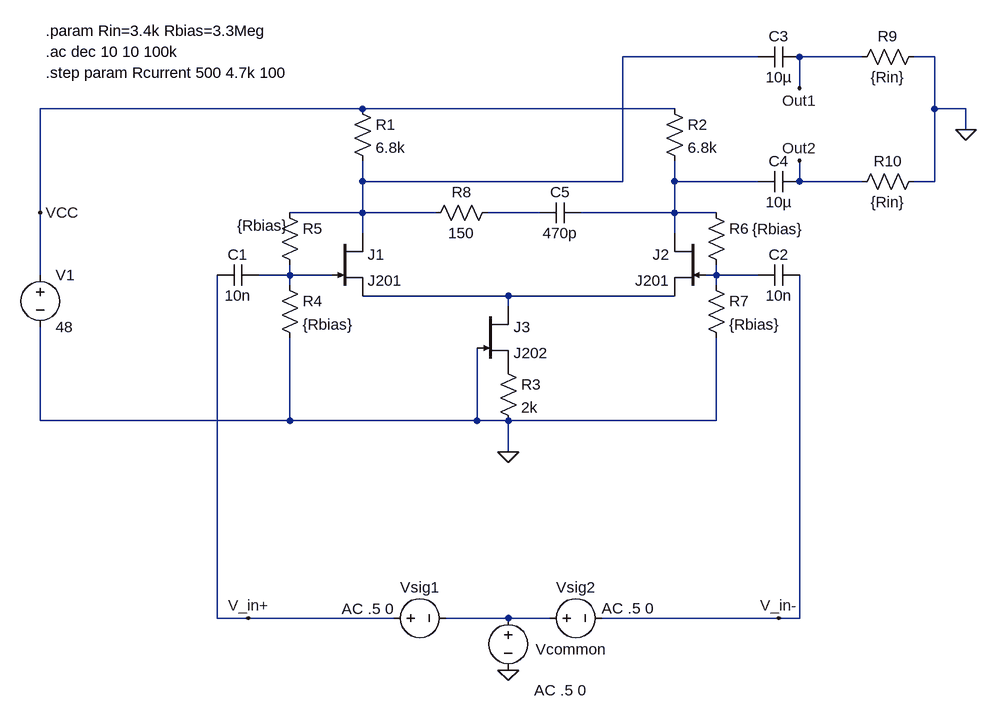
[diagram p0: schematic Preamp_LoGain.asc]
Preamp_LoGain.asc, the LTspice schematic file:
Version 4
SHEET 1 1804 1088
WIRE 928 96 720 96
WIRE 1088 96 992 96
WIRE 1200 96 1168 96
WIRE 992 144 992 96
WIRE 320 176 -176 176
WIRE 800 176 320 176
WIRE 1200 176 1200 96
WIRE 1248 176 1200 176
WIRE 1248 208 1248 176
WIRE 320 288 320 256
WIRE 720 288 720 96
WIRE 720 288 320 288
WIRE 800 288 800 256
WIRE 928 288 800 288
WIRE 992 288 992 256
WIRE 1088 288 992 288
WIRE 1200 288 1200 176
WIRE 1200 288 1168 288
WIRE -176 336 -176 176
WIRE 320 336 320 288
WIRE 320 336 208 336
WIRE 432 336 320 336
WIRE 592 336 512 336
WIRE 800 336 800 288
WIRE 800 336 656 336
WIRE 864 336 800 336
WIRE 320 368 320 336
WIRE 800 368 800 336
WIRE -176 432 -176 336
WIRE 208 432 208 416
WIRE 208 432 160 432
WIRE 272 432 208 432
WIRE 864 432 864 416
WIRE 864 432 848 432
WIRE 928 432 864 432
WIRE 208 448 208 432
WIRE 864 448 864 432
WIRE 544 464 320 464
WIRE 800 464 544 464
WIRE 544 480 544 464
WIRE -176 656 -176 512
WIRE 208 656 208 528
WIRE 208 656 -176 656
WIRE 496 656 496 544
WIRE 496 656 208 656
WIRE 544 656 496 656
WIRE 864 656 864 528
WIRE 864 656 544 656
WIRE 544 704 544 656
WIRE 96 960 96 432
WIRE 144 960 96 960
WIRE 368 960 144 960
WIRE 544 960 448 960
WIRE 608 960 544 960
WIRE 960 960 688 960
WIRE 992 960 992 432
WIRE 992 960 960 960
FLAG 544 704 0
FLAG -176 336 VCC
FLAG 992 144 Out1
FLAG 992 256 Out2
FLAG 1248 208 0
FLAG 960 960 V_in-
FLAG 144 960 V_in+
FLAG 544 1040 0
SYMBOL njf 272 368 R0
SYMATTR InstName J1
SYMATTR Value J201
SYMBOL njf 848 368 M0
SYMATTR InstName J2
SYMATTR Value J201
SYMBOL res 304 160 R0
SYMATTR InstName R1
SYMATTR Value 6.8k
SYMBOL res 784 160 R0
SYMATTR InstName R2
SYMATTR Value 6.8k
SYMBOL res 528 560 R0
SYMATTR InstName R3
SYMATTR Value 2k
SYMBOL res 192 432 R0
SYMATTR InstName R4
SYMATTR Value {Rbias}
SYMBOL res 192 320 R0
WINDOW 3 -65 36 Left 2
SYMATTR Value {Rbias}
SYMATTR InstName R5
SYMBOL res 848 320 R0
WINDOW 3 71 41 Left 2
SYMATTR Value {Rbias}
SYMATTR InstName R6
SYMBOL res 848 432 R0
SYMATTR InstName R7
SYMATTR Value {Rbias}
SYMBOL cap 160 416 R90
WINDOW 0 0 32 VBottom 2
WINDOW 3 32 32 VTop 2
SYMATTR InstName C1
SYMATTR Value 10n
SYMATTR SpiceLine Rser=882.6m Lser=318.58p
SYMBOL cap 992 416 R90
WINDOW 0 0 32 VBottom 2
WINDOW 3 32 32 VTop 2
SYMATTR InstName C2
SYMATTR Value 10n
SYMATTR SpiceLine Rser=786.2m Lser=151.38p
SYMBOL cap 992 80 R90
WINDOW 0 0 32 VBottom 2
WINDOW 3 32 32 VTop 2
SYMATTR InstName C3
SYMATTR Value 10µ
SYMATTR SpiceLine Rser=27.8m Lser=187.57p
SYMBOL cap 992 272 R90
WINDOW 0 0 32 VBottom 2
WINDOW 3 32 32 VTop 2
SYMATTR InstName C4
SYMATTR Value 10µ
SYMATTR SpiceLine Rser=16.5m Lser=200.49p
SYMBOL voltage -176 416 R0
SYMATTR InstName V1
SYMATTR Value 48
SYMATTR SpiceLine Rser=0
SYMBOL voltage 352 960 R270
WINDOW 0 32 56 VTop 2
WINDOW 3 -32 56 VBottom 2
WINDOW 123 30 -24 VBottom 2
SYMATTR InstName Vsig1
SYMATTR Value ""
SYMATTR Value2 AC .5 0
SYMATTR SpiceLine Rser=0
SYMBOL njf 496 480 R0
SYMATTR InstName J3
SYMATTR Value J202
SYMBOL res 1184 80 R90
WINDOW 0 0 56 VBottom 2
WINDOW 3 32 56 VTop 2
SYMATTR InstName R9
SYMATTR Value {Rin}
SYMBOL res 1184 272 R90
WINDOW 0 0 56 VBottom 2
WINDOW 3 32 56 VTop 2
SYMATTR InstName R10
SYMATTR Value {Rin}
SYMBOL res 528 320 R90
WINDOW 0 0 56 VBottom 2
WINDOW 3 32 56 VTop 2
SYMATTR InstName R8
SYMATTR Value 150
SYMBOL cap 656 320 R90
WINDOW 0 0 32 VBottom 2
WINDOW 3 32 32 VTop 2
SYMATTR InstName C5
SYMATTR Value 470p
SYMATTR SpiceLine Rser=16.5m Lser=200.49p
SYMBOL voltage 592 960 R270
WINDOW 0 32 56 VTop 2
WINDOW 3 -32 56 VBottom 2
WINDOW 123 31 136 VBottom 2
SYMATTR InstName Vsig2
SYMATTR Value ""
SYMATTR Value2 AC .5 0
SYMATTR SpiceLine Rser=0
SYMBOL voltage 544 944 R0
WINDOW 0 42 64 Left 2
WINDOW 3 40 99 Left 2
WINDOW 123 40 127 Left 2
WINDOW 39 0 0 Left 0
SYMATTR InstName Vcommon
SYMATTR Value ""
SYMATTR Value2 AC .5 0
TEXT -168 88 Left 2 !.ac dec 10 10 100k
TEXT -168 56 Left 2 !.param Rin=3.4k Rbias=3.3Meg
TEXT -168 120 Left 2 !.step param Rcurrent 500 4.7k 100

The netlist it stands for:
* Preamp_LoGain.asc
J1 N001 N004 N006 J201
J2 N002 N005 N006 J201
R1 VCC N001 6.8k
R2 VCC N002 6.8k
R3 P001 0 2k
R4 N004 0 {Rbias}
R5 N001 N004 {Rbias}
R6 N002 N005 {Rbias}
R7 N005 0 {Rbias}
C1 N004 V_in+ 10n Rser=882.6m Lser=318.58p
C2 V_in- N005 10n Rser=786.2m Lser=151.38p
C3 Out1 N001 10µ Rser=27.8m Lser=187.57p
C4 Out2 N002 10µ Rser=16.5m Lser=200.49p
V1 VCC 0 48 Rser=0
Vsig1 V_in+ N007 AC .5 0 Rser=0
J3 N006 0 P001 J202
R9 0 Out1 {Rin}
R10 0 Out2 {Rin}
R8 N003 N001 150
C5 N002 N003 470p Rser=16.5m Lser=200.49p
Vsig2 N007 V_in- AC .5 0 Rser=0
Vcommon N007 0 AC .5 0
.model NJF NJF
.model PJF PJF
.lib standard.jft
.ac dec 10 10 100k
.param Rin=3.4k Rbias=3.3Meg
.step param Rcurrent 500 4.7k 100
.backanno
.end